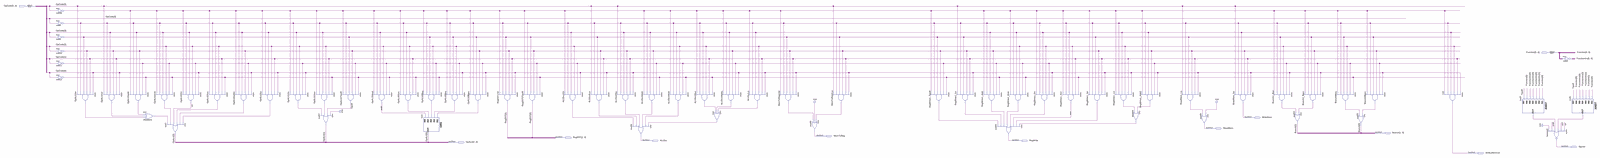
[diagram p0: schematic sheet, whole]
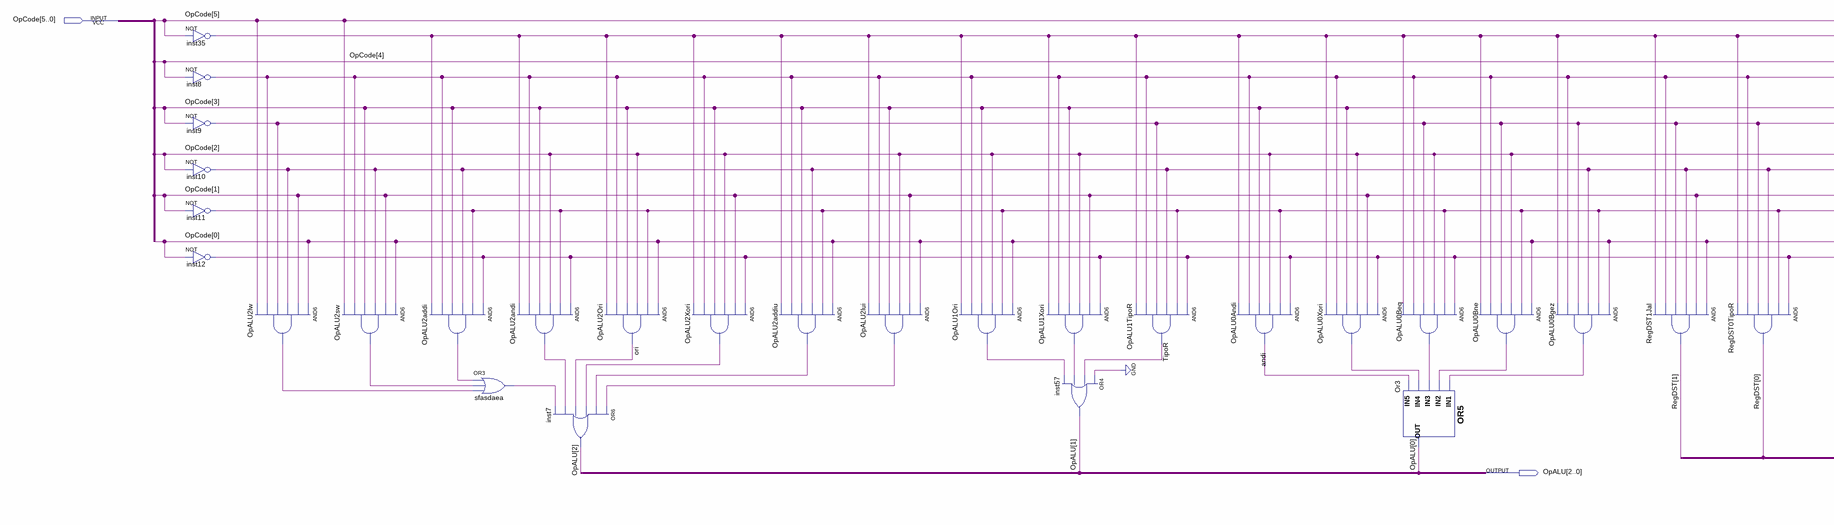
[diagram p1: schematic sheet, left part]
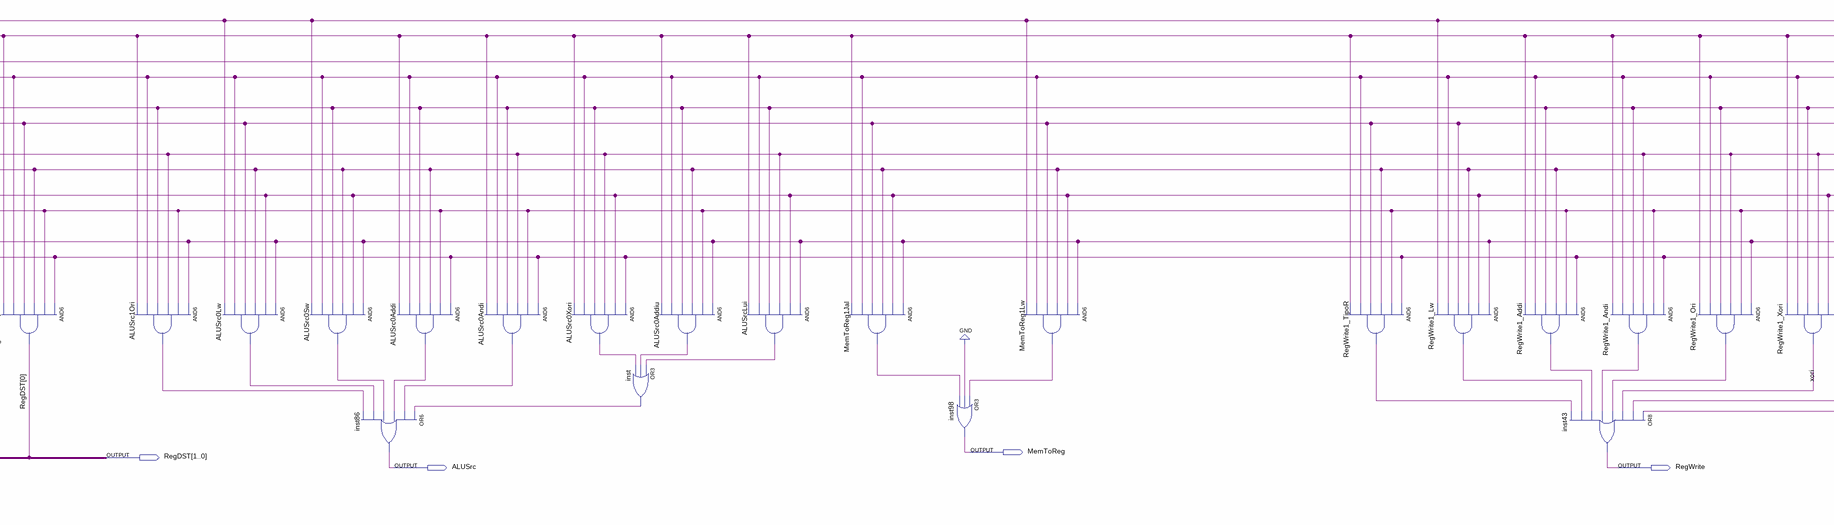
[diagram p2: schematic sheet, centre part]
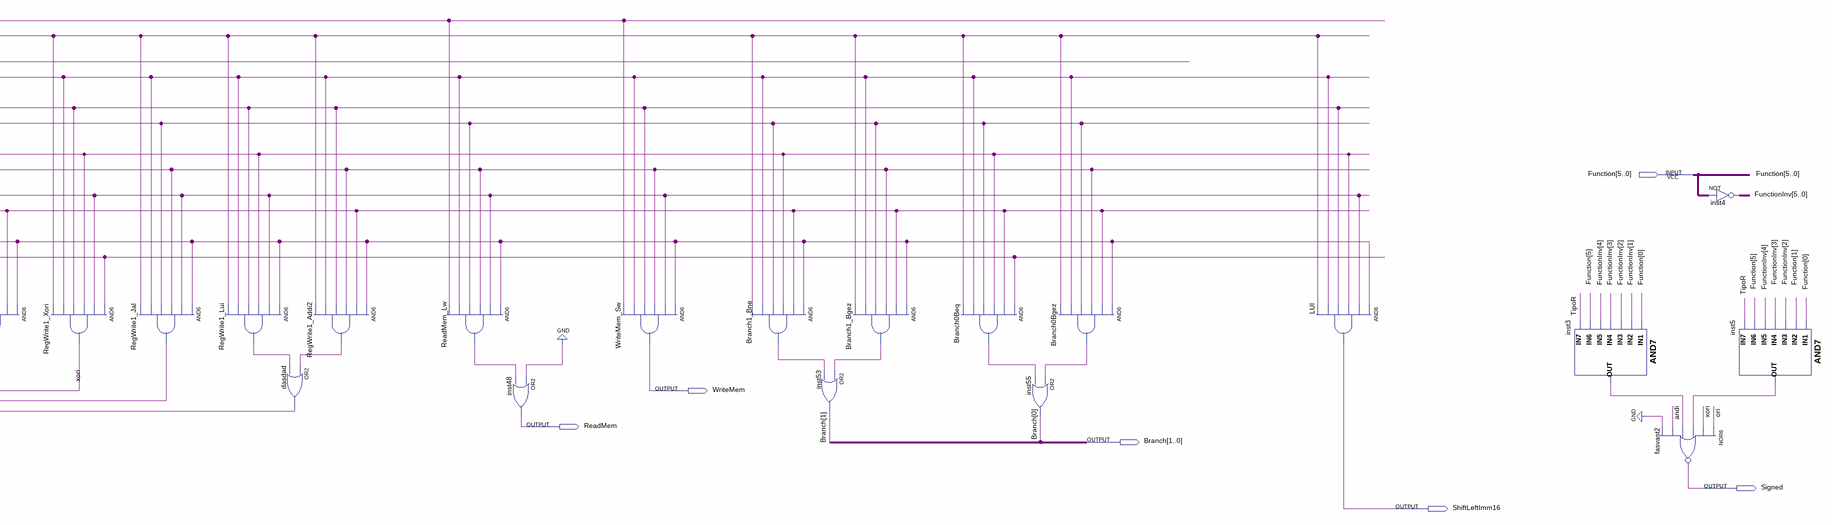
[diagram p3: schematic sheet, right part]
// Quartus schematic Controlador.bdf as structural Verilog: 66 symbols, 12 pins
module Controlador (
  input  [5:0] OpCode,
  input  [5:0] Function,
  output WriteMem,
  output ReadMem,
  output [1:0] Branch,
  output MemToReg,
  output [1:0] RegDST,
  output ALUSrc,
  output RegWrite,
  output [2:0] OpALU,
  output Signed,
  output ShiftLeftImm16
);

  wire ALUSrc0Addi_out, ALUSrc0Addiu_out, ALUSrc0Andi_out, ALUSrc0Lw_out, ALUSrc0Sw_out, ALUSrc0Xori_out,
       ALUSrc1Ori_out, ALUSrcLui_out, andi, Branch0Beq_out, Branch0Bgez_out, Branch1_Bgez_out,
       Branch1_Bne_out, dasdad_out, inst3_out, inst5_out, inst8_out, inst9_out, inst10_out, inst11_out,
       inst12_out, inst35_out, inst_out, MemToReg1Jal_out, MemToReg1Lw_out, OpALU0Beq_out, OpALU0Bgez_out,
       OpALU0Bne_out, OpALU0Xori_out, OpALU1Ori_out, OpALU1Xori_out, OpALU2addi_out, OpALU2addiu_out,
       OpALU2andi_out, OpALU2lui_out, OpALU2lw_out, OpALU2sw_out, OpALU2Xori_out, ori, ReadMem_Lw_out,
       RegWrite1_Addi2_out, RegWrite1_Addi_out, RegWrite1_Andi_out, RegWrite1_Jal_out, RegWrite1_Lui_out,
       RegWrite1_Lw_out, RegWrite1_Ori_out, RegWrite1_TipoR_out, sfasdaea_out, TipoR, xori;
  wire [5:0] FunctionInv;

  not inst35 (inst35_out, OpCode[5]);
  not inst8 (inst8_out, OpCode[4]);
  not inst9 (inst9_out, OpCode[3]);
  not inst10 (inst10_out, OpCode[2]);
  not inst11 (inst11_out, OpCode[1]);
  not inst12 (inst12_out, OpCode[0]);
  and OpALU2lw (OpALU2lw_out, OpCode[0], OpCode[1], inst10_out, inst9_out, inst8_out, OpCode[5]);
  and OpALU2sw (OpALU2sw_out, OpCode[0], OpCode[1], inst10_out, OpCode[3], inst8_out, OpCode[5]);
  and OpALU2addi (OpALU2addi_out, inst12_out, inst11_out, inst10_out, OpCode[3], inst8_out, inst35_out);
  or sfasdaea (sfasdaea_out, OpALU2addi_out, OpALU2sw_out, OpALU2lw_out);
  and OpALU2andi (OpALU2andi_out, inst12_out, inst11_out, OpCode[2], OpCode[3], inst8_out, inst35_out);
  or inst7 (OpALU[2], OpALU2lui_out, OpALU2addiu_out, OpALU2Xori_out, ori, OpALU2andi_out, sfasdaea_out);
  and OpALU2Ori (ori, OpCode[0], inst11_out, OpCode[2], OpCode[3], inst8_out, inst35_out);
  and OpALU2Xori (OpALU2Xori_out, inst12_out, OpCode[1], OpCode[2], OpCode[3], inst8_out, inst35_out);
  and OpALU2addiu (OpALU2addiu_out, OpCode[0], inst11_out, inst10_out, OpCode[3], inst8_out, inst35_out);
  and OpALU2lui (OpALU2lui_out, OpCode[0], OpCode[1], OpCode[2], OpCode[3], inst8_out, inst35_out);
  and OpALU1Ori (OpALU1Ori_out, OpCode[0], inst11_out, OpCode[2], OpCode[3], inst8_out, inst35_out);
  and OpALU1Xori (OpALU1Xori_out, inst12_out, OpCode[1], OpCode[2], OpCode[3], inst8_out, inst35_out);
  or inst57 (OpALU[1], 1'b0, TipoR, OpALU1Xori_out, OpALU1Ori_out);
  and OpALU1TipoR (TipoR, inst12_out, inst11_out, inst10_out, inst9_out, inst8_out, inst35_out);
  and OpALU0Andi (andi, inst12_out, inst11_out, OpCode[2], OpCode[3], inst8_out, inst35_out);
  and OpALU0Xori (OpALU0Xori_out, inst12_out, OpCode[1], OpCode[2], OpCode[3], inst8_out, inst35_out);
  and OpALU0Beq (OpALU0Beq_out, inst12_out, inst11_out, OpCode[2], inst9_out, inst8_out, inst35_out);
  or Or3 (OpALU[0], OpALU0Bgez_out, OpALU0Bne_out, OpALU0Beq_out, OpALU0Xori_out, andi);
  and OpALU0Bne (OpALU0Bne_out, OpCode[0], inst11_out, OpCode[2], inst9_out, inst8_out, inst35_out);
  and OpALU0Bgez (OpALU0Bgez_out, OpCode[0], inst11_out, inst10_out, inst9_out, inst8_out, inst35_out);
  and RegDST1Jal (RegDST[1], OpCode[0], OpCode[1], inst10_out, inst9_out, inst8_out, inst35_out);
  and RegDST0TipoR (RegDST[0], inst12_out, inst11_out, inst10_out, inst9_out, inst8_out, inst35_out);
  and ALUSrc1Ori (ALUSrc1Ori_out, OpCode[0], inst11_out, OpCode[2], OpCode[3], inst8_out, inst35_out);
  and ALUSrc0Lw (ALUSrc0Lw_out, OpCode[0], OpCode[1], inst10_out, inst9_out, inst8_out, OpCode[5]);
  and ALUSrc0Sw (ALUSrc0Sw_out, OpCode[0], OpCode[1], inst10_out, OpCode[3], inst8_out, OpCode[5]);
  or inst86 (ALUSrc, inst_out, ALUSrc0Andi_out, ALUSrc0Addi_out, ALUSrc0Sw_out, ALUSrc0Lw_out, ALUSrc1Ori_out);
  and ALUSrc0Addi (ALUSrc0Addi_out, inst12_out, inst11_out, inst10_out, OpCode[3], inst8_out, inst35_out);
  and ALUSrc0Andi (ALUSrc0Andi_out, inst12_out, inst11_out, OpCode[2], OpCode[3], inst8_out, inst35_out);
  and ALUSrc0Xori (ALUSrc0Xori_out, inst12_out, OpCode[1], OpCode[2], OpCode[3], inst8_out, inst35_out);
  and ALUSrc0Addiu (ALUSrc0Addiu_out, OpCode[0], inst11_out, inst10_out, OpCode[3], inst8_out, inst35_out);
  or inst (inst_out, ALUSrcLui_out, ALUSrc0Addiu_out, ALUSrc0Xori_out);
  and ALUSrcLui (ALUSrcLui_out, OpCode[0], OpCode[1], OpCode[2], OpCode[3], inst8_out, inst35_out);
  and MemToReg1Jal (MemToReg1Jal_out, OpCode[0], OpCode[1], inst10_out, inst9_out, inst8_out, inst35_out);
  or inst98 (MemToReg, MemToReg1Lw_out, 1'b0, MemToReg1Jal_out);
  and MemToReg1Lw (MemToReg1Lw_out, OpCode[0], OpCode[1], inst10_out, inst9_out, inst8_out, OpCode[5]);
  and RegWrite1_TipoR (RegWrite1_TipoR_out, inst12_out, inst11_out, inst10_out, inst9_out, inst8_out, inst35_out);
  and RegWrite1_Lw (RegWrite1_Lw_out, OpCode[0], OpCode[1], inst10_out, inst9_out, inst8_out, OpCode[5]);
  and RegWrite1_Addi (RegWrite1_Addi_out, inst12_out, inst11_out, inst10_out, OpCode[3], inst8_out, inst35_out);
  or inst43 (RegWrite, dasdad_out, RegWrite1_Jal_out, xori, RegWrite1_Ori_out, RegWrite1_Andi_out, RegWrite1_Addi_out, RegWrite1_Lw_out, RegWrite1_TipoR_out);
  and RegWrite1_Andi (RegWrite1_Andi_out, inst12_out, inst11_out, OpCode[2], OpCode[3], inst8_out, inst35_out);
  and RegWrite1_Ori (RegWrite1_Ori_out, OpCode[0], inst11_out, OpCode[2], OpCode[3], inst8_out, inst35_out);
  and RegWrite1_Xori (xori, inst12_out, OpCode[1], OpCode[2], OpCode[3], inst8_out, inst35_out);
  and RegWrite1_Jal (RegWrite1_Jal_out, OpCode[0], OpCode[1], inst10_out, inst9_out, inst8_out, inst35_out);
  and RegWrite1_Lui (RegWrite1_Lui_out, OpCode[0], OpCode[1], OpCode[2], OpCode[3], inst8_out, inst35_out);
  or dasdad (dasdad_out, RegWrite1_Addi2_out, RegWrite1_Lui_out);
  and RegWrite1_Addi2 (RegWrite1_Addi2_out, OpCode[0], inst11_out, inst10_out, OpCode[3], inst8_out, inst35_out);
  and ReadMem_Lw (ReadMem_Lw_out, OpCode[0], OpCode[1], inst10_out, inst9_out, inst8_out, OpCode[5]);
  or inst48 (ReadMem, 1'b0, ReadMem_Lw_out);
  and WriteMem_Sw (WriteMem, OpCode[0], OpCode[1], inst10_out, OpCode[3], inst8_out, OpCode[5]);
  and Branch1_Bne (Branch1_Bne_out, OpCode[0], inst11_out, OpCode[2], inst9_out, inst8_out, inst35_out);
  or inst53 (Branch[1], Branch1_Bgez_out, Branch1_Bne_out);
  and Branch1_Bgez (Branch1_Bgez_out, OpCode[0], inst11_out, inst10_out, inst9_out, inst8_out, inst35_out);
  and Branch0Beq (Branch0Beq_out, inst12_out, inst11_out, OpCode[2], inst9_out, inst8_out, inst35_out);
  and Branch0Bgez (Branch0Bgez_out, OpCode[0], inst11_out, inst10_out, inst9_out, inst8_out, inst35_out);
  or inst55 (Branch[0], Branch0Bgez_out, Branch0Beq_out);
  and LUI (ShiftLeftImm16, OpCode[0], OpCode[1], OpCode[2], OpCode[3], inst8_out, inst35_out);
  and inst3 (inst3_out, Function[0], FunctionInv[1], FunctionInv[2], FunctionInv[3], FunctionInv[4], Function[5], TipoR);
  nor fasvast2 (Signed, ori, xori, inst5_out, inst3_out, andi, 1'b0);
  assign FunctionInv = ~Function;  // NOT inst4, 6 bits wide
  and inst5 (inst5_out, Function[0], Function[1], FunctionInv[2], FunctionInv[3], FunctionInv[4], Function[5], TipoR);
endmodule
